# Altium schematic sheet TopLevel.SchDoc
size Letter
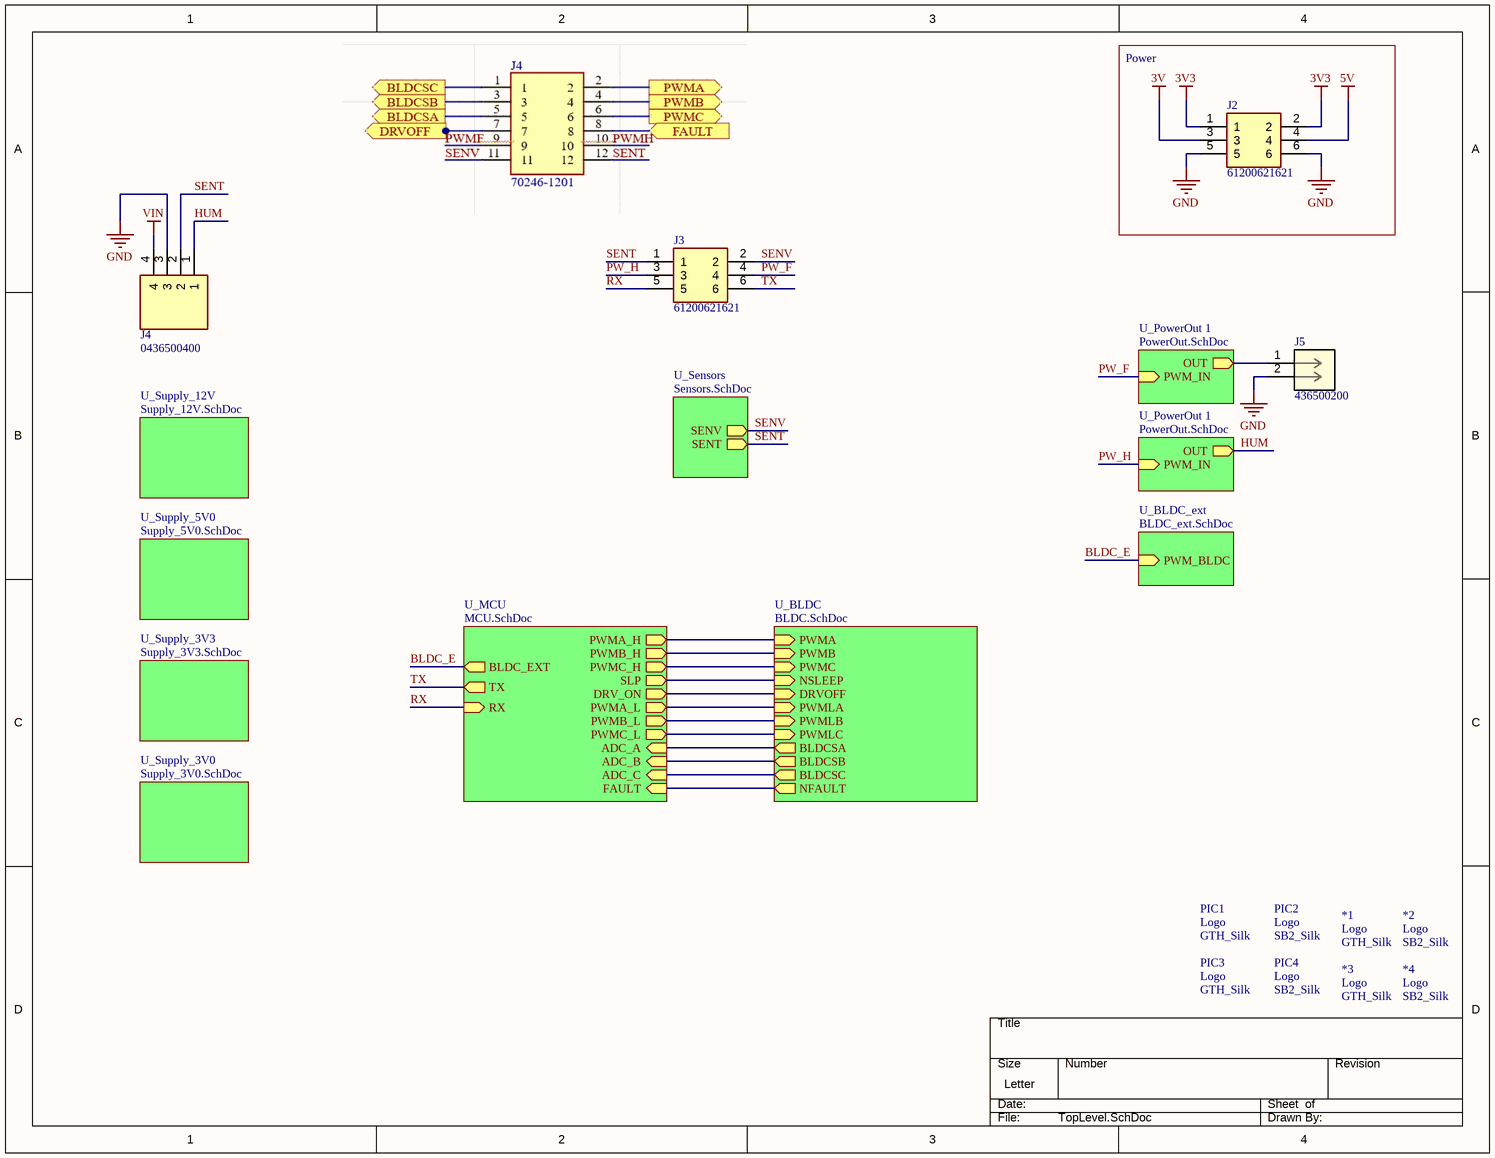
[diagram p0: TopLevel.SchDoc]

## Parts
*1  GTH_Silk  [TECHHUB_SILK]
*2  SB2_Silk  [SMARTBEDDING2_SILK]
*3  GTH_Silk  [TECHHUB_SILK]
*4  SB2_Silk  [SMARTBEDDING2_SILK]
J2  61200621621  [SHDR6W64P254_2X3_1528X910X910P]
J3  61200621621  [SHDR6W64P254_2X3_1528X910X910P]
J4  0436500400  [MOLEX_0436500400]
J5  436500200  [CONN_SD-43650-001_02_MOL]
PIC1  GTH_Silk  [TECHHUB_SILK]
PIC2  SB2_Silk  [SMARTBEDDING2_SILK]
PIC3  GTH_Silk  [TECHHUB_SILK]
PIC4  SB2_Silk  [SMARTBEDDING2_SILK]

## Blocks framed on the sheet
Power: J2

## Sub-sheets
U_BLDC = BLDC.SchDoc: PWMA (in), PWMB (in), PWMC (in), NSLEEP (in), BLDCSA (out), BLDCSB (out), BLDCSC (out), NFAULT (out), DRVOFF (in), PWMLA (in), PWMLB (in), PWMLC (in)
U_BLDC_ext = BLDC_ext.SchDoc: PWM_BLDC (in)
U_MCU = MCU.SchDoc: PWMA_L (out), PWMB_L (out), PWMC_L (out), PWMA_H (out), PWMB_H (out), PWMC_H (out), ADC_A (in), ADC_B (in), ADC_C (in), FAULT (in), SLP (out), DRV_ON (out), BLDC_EXT (out), TX (out), RX (in)
U_PowerOut 1 = PowerOut.SchDoc: PWM_IN (in), OUT (out)
U_PowerOut 1 = PowerOut.SchDoc: PWM_IN (in), OUT (out)
U_Sensors = Sensors.SchDoc: SENV (out), SENT (out)
U_Supply_3V0 = Supply_3V0.SchDoc: no entries
U_Supply_3V3 = Supply_3V3.SchDoc: no entries
U_Supply_5V0 = Supply_5V0.SchDoc: no entries
U_Supply_12V = Supply_12V.SchDoc: no entries

## Nets
3V: J2.3
3V3: J2.1 J2.2
5V: J2.4
GND: J2.5 J2.6 J4.3 J5.2
VIN: J4.4
BLDC_E: sheet U_BLDC_ext/PWM_BLDC, sheet U_MCU/BLDC_EXT
HUM: J4.1 ; sheet U_PowerOut 1/OUT
PW_F: J3.4 ; sheet U_PowerOut 1/PWM_IN
PW_H: J3.3 ; sheet U_PowerOut 1/PWM_IN
RX: J3.5 ; sheet U_MCU/RX
SENT: J3.1 J4.2 ; sheet U_Sensors/SENT
SENV: J3.2 ; sheet U_Sensors/SENV
TX: J3.6 ; sheet U_MCU/TX
NetJ5_1: J5.1 ; sheet U_PowerOut 1/OUT
(unnamed): sheet U_BLDC/PWMA, sheet U_MCU/PWMA_H
(unnamed): sheet U_BLDC/PWMB, sheet U_MCU/PWMB_H
(unnamed): sheet U_BLDC/PWMC, sheet U_MCU/PWMC_H
(unnamed): sheet U_BLDC/NSLEEP, sheet U_MCU/SLP
(unnamed): sheet U_BLDC/BLDCSA, sheet U_MCU/ADC_A
(unnamed): sheet U_BLDC/BLDCSB, sheet U_MCU/ADC_B
(unnamed): sheet U_BLDC/BLDCSC, sheet U_MCU/ADC_C
(unnamed): sheet U_BLDC/NFAULT, sheet U_MCU/FAULT
(unnamed): sheet U_BLDC/DRVOFF, sheet U_MCU/DRV_ON
(unnamed): sheet U_BLDC/PWMLA, sheet U_MCU/PWMA_L
(unnamed): sheet U_BLDC/PWMLB, sheet U_MCU/PWMB_L
(unnamed): sheet U_BLDC/PWMLC, sheet U_MCU/PWMC_L

## Notes on the sheet
- DWG. NO.
- REV.
- SHT.
- REVISION
- DESCRIPTION
- DATE
- APPROVED
- THIS DOCUMENT AND THE DATA DISCLOSED HEREIN OR HEREWITH IS THE PROPERTY OF ALTIUM LIMITED AND MAY BE FREELY DISTRIBUTED IN WHOLE. NO RIGHTS ARE RESERVED OR EXPRESS OR IMPLIED WARANTEE GIVEN.
- ENG:
- DSN:
- APPROVALS
- PROJECT
- DOCUMENT REVISION:
- DESIGN ITEM:
- CHK:
- BOM:
- REFERENCE DOCUMENTS
- PROJECT REVISION:
- TITLE
- FAB DWG:
- PCB DWG:
- ASSY DWG:
- SCALE:
- SIZE
- C
- CAGE CODE
- FILE NAME
- DWG NO.
- SHEET
- OF
- REV
- (in symbol GTH_Silk) Logo
- (in symbol SB2_Silk) Logo

## Library data of the parts
J2 J3 = 61200621621: Wurth Elektronik PCB Header WR-BHD, 6 Way, 2.54mm Pitch, 2 Row, Straight, Through Hole; Geometry.Height: 9.1mm; Manufacturer_Name: Wurth Elektronik; Manufacturer_Part_Number: 61200621621; Mouser Part Number: 710-61200621621; Mouser Price/Stock: https://www.mouser.co.uk/ProductDetail/Wurth-Elektronik/61200621621?qs=PhR8RmCirEbjX8n1RKw4Jw%3D%3D; Arrow Part Number: *; Arrow Price/Stock: *; Datasheet Link: https://katalog.we-online.de/em/datasheet/6120xx21621.pdf
J4 = 0436500400: Micro-fit 3.0 Connector, 4 Circuit Single Row, Right Angle Throughhole PCB, Snap-In Peg; MF: Molex; MP: 0436500400; SnapEDA_Link: https://www.snapeda.com/parts/0436500400/Molex/view-part/1776823/?ref=snap; Price: None; Package: None; Availability: Unavailable; Value: *
J5 = 436500200: No Description Available; Mfr_Name: Molex Connector Corporation; RefDes: RefDes; Type: Type